# EAGLE design ADC_SPI (EAGLE 9.2.2)
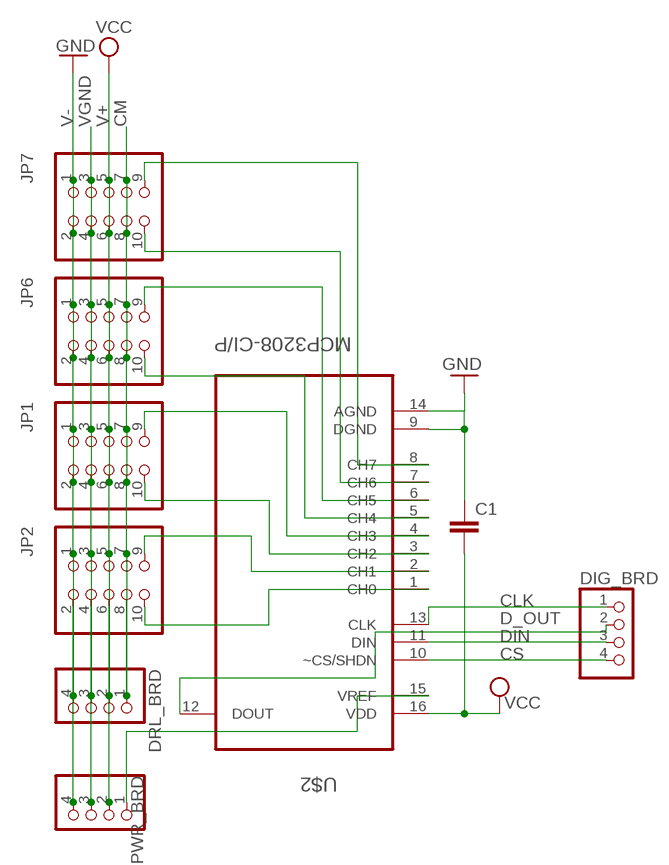
[diagram p0: schematic, sheet 1]

## Parts
C1  C2.5/2  [C2.5-2]
DIG_BRD  PINHD-1X4  [1X04]
DRL_BRD  PINHD-1X4  [1X04]
JP1  PINHD-2X5  [2X05]
JP2  PINHD-2X5  [2X05]
JP6  PINHD-2X5  [2X05]
JP7  PINHD-2X5  [2X05]
PWR_BRD  PINHD-1X4  [1X04]
U$2  MCP3208-CI/P  [DIP254P762X432-16]

## Nets
CLK: DIG_BRD.1 U$2.13(CLK)
CM: DRL_BRD.1 JP1.7 JP1.8 JP2.7 JP2.8 JP6.7 JP6.8 JP7.7 JP7.8
CS: DIG_BRD.4 U$2.10(~CS/SHDN)
D_OUT: DIG_BRD.2 U$2.12(DOUT)
DIN: DIG_BRD.3 U$2.11(DIN)
GND: C1.1 U$2.9(DGND) U$2.14(AGND)
N$1: JP2.10 U$2.1(CH0)
N$2: PWR_BRD.1 U$2.15(VREF)
N$17: JP7.9 U$2.8(CH7)
N$18: JP7.10 U$2.7(CH6)
N$19: JP6.9 U$2.6(CH5)
N$20: JP6.10 U$2.5(CH4)
N$21: JP1.9 U$2.4(CH3)
N$25: JP1.10 U$2.3(CH2)
N$32: JP2.9 U$2.2(CH1)
V+: DRL_BRD.2 JP1.5 JP1.6 JP2.5 JP2.6 JP6.5 JP6.6 JP7.5 JP7.6 PWR_BRD.2 ; supply symbol labelled VCC
V-: DRL_BRD.4 JP1.1 JP1.2 JP2.1 JP2.2 JP6.1 JP6.2 JP7.1 JP7.2 PWR_BRD.4 ; supply symbol labelled GND
VCC: C1.2 U$2.16(VDD)
VGND: DRL_BRD.3 JP1.3 JP1.4 JP2.3 JP2.4 JP6.3 JP6.4 JP7.3 JP7.4 PWR_BRD.3

## Library data of the parts
C1 = capacitor-wima:C: CAPACITOR naming: grid - package width
DIG_BRD DRL_BRD PWR_BRD = pinhead:PINHD-1X4: PIN HEADER
JP1 JP2 JP6 JP7 = pinhead:PINHD-2X5: PIN HEADER
U$2 = MCP3208-CI_P:MCP3208-CI/P: A/D Converters; AVAILABILITY: Good; DESCRIPTION: 8 Channel SPI Serial Interface 2.7 V 12-Bit A/D Converter Through Hole - PDIP-16; MF: Microchip; MP: MCP3208-CI/P; PACKAGE: DIP-16 Microchip; PRICE: 3.21 USD

## Net classes
0 default: width 0.254 mm, clearance 0.254 mm

## Board
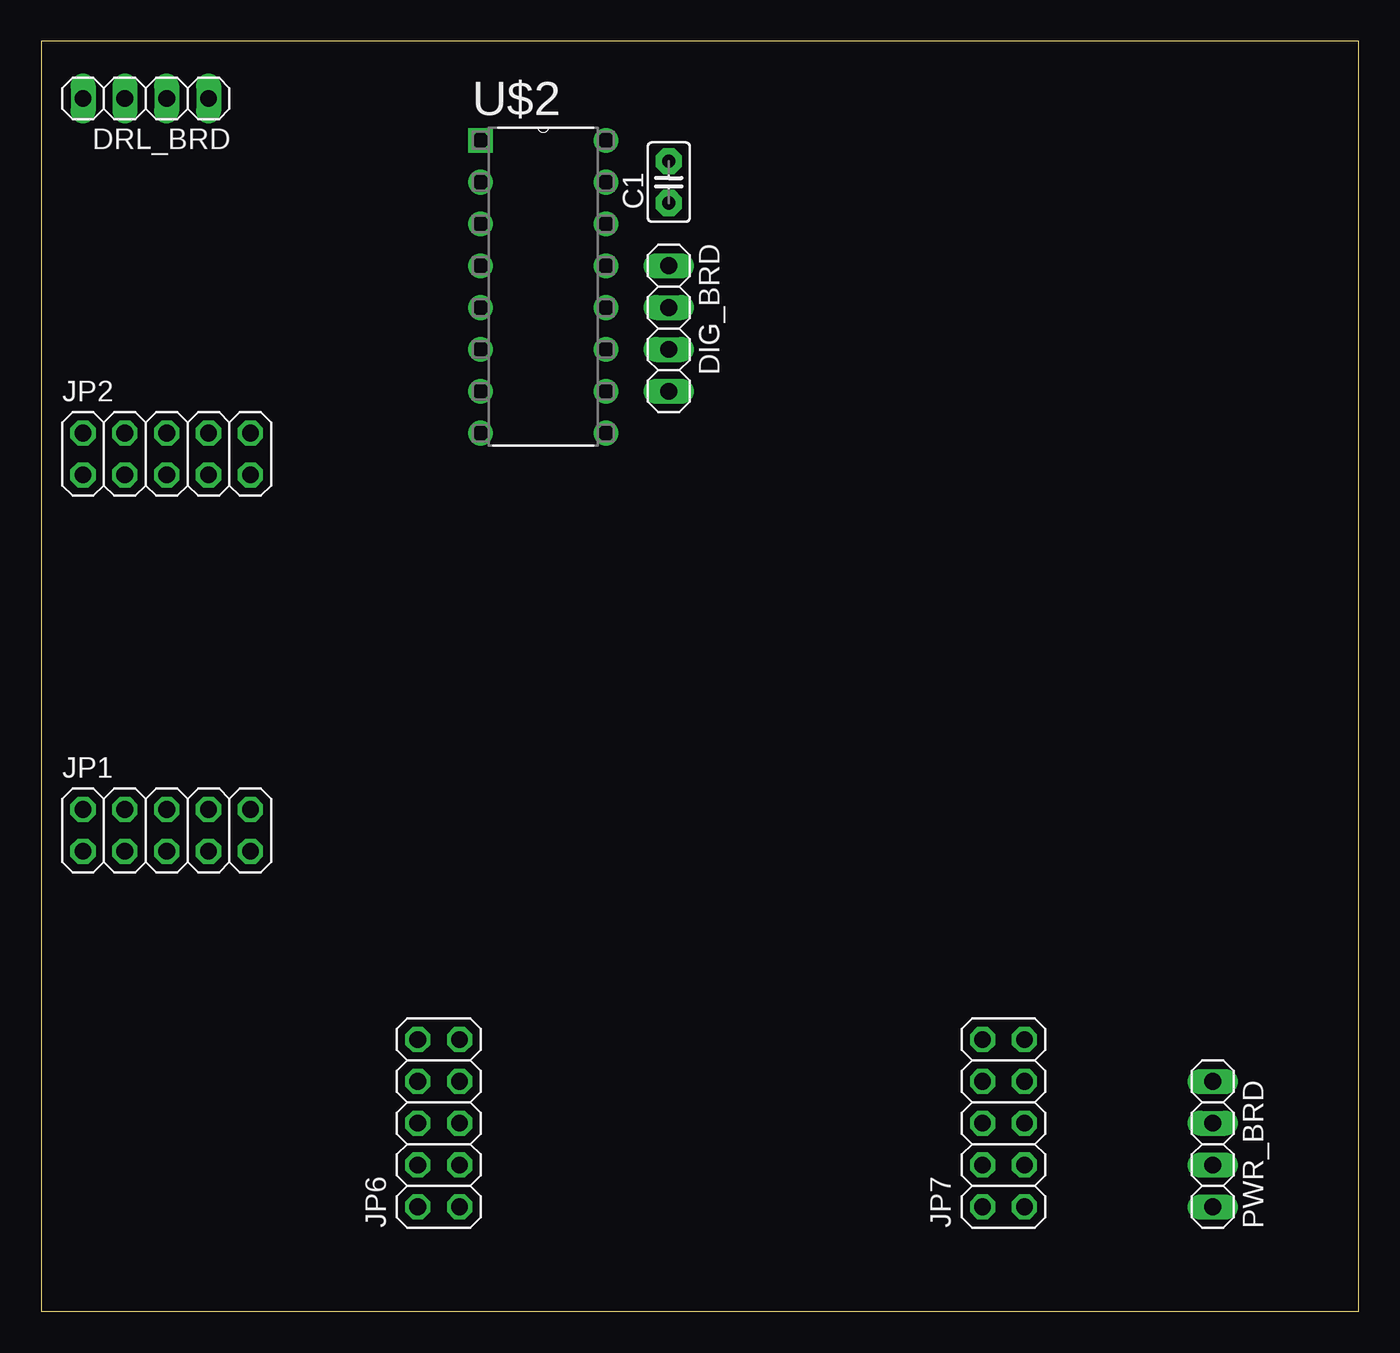
[diagram p1: board, top side]
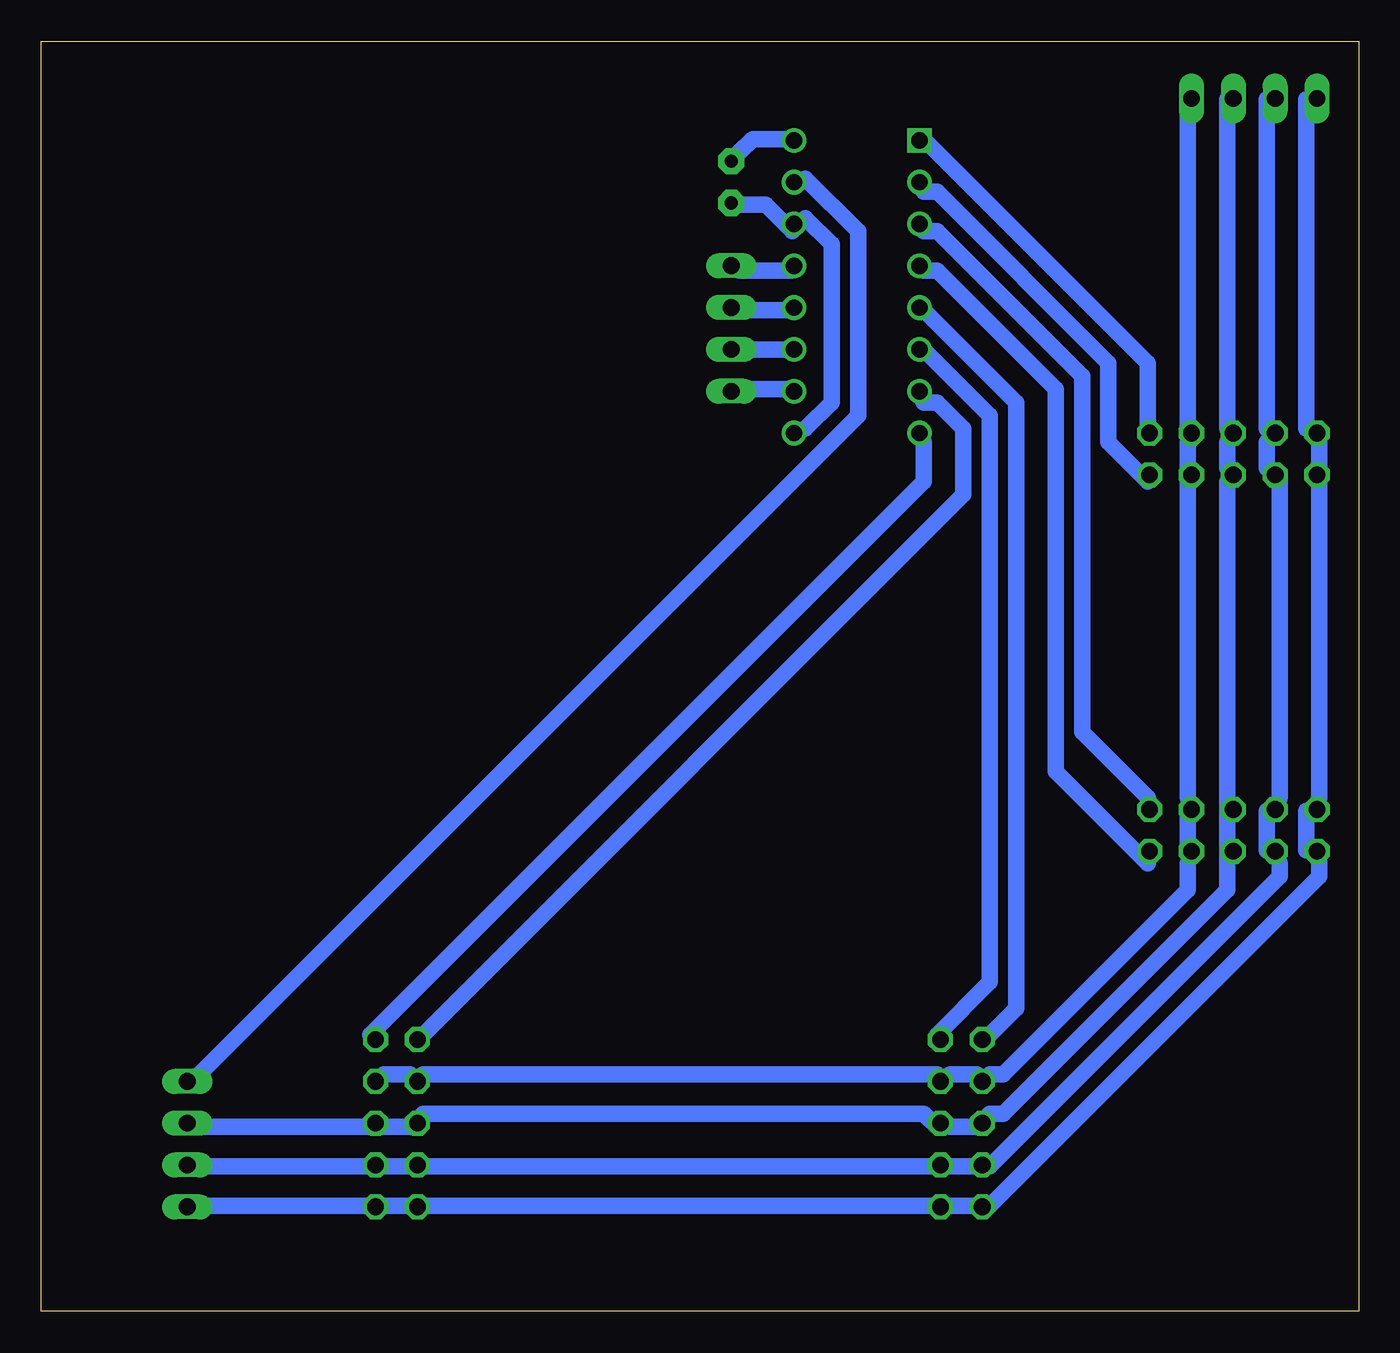
[diagram p2: board, bottom side, seen from below]

Size 79.99 x 77.14 mm. Coordinates in mm from the lower left corner, seen from the top.
Outline: 0,0 79.99,0 79.99,77.14 0,77.14 0,0
Copper layers (1*16): Top 0.035mm / dielectric 1.5mm / Bottom 0.035mm
Design rules "default *": minimum track width 1mm, minimum drill 0.35mm, track to track 0.6mm, track to pad 0.6mm, pad to pad 0.6mm, via to via 0.6mm, smd to smd 6mil, copper to edge 40mil, drill to drill 6mil, minimum pad ring 10mil, minimum via ring 8mil, stop-mask expansion 4mil, vias tented up to drill 0mil, thermal gap 10mil

### Footprints (pad centres in the part's own frame; a part is rotated, then mirrored left to right if it is on the bottom)
C2.5-2 = drill 0.813 pad 1.6 octagon: 1 -1.27,0; 2 1.27,0
1X04 = drill 1.016 long: 1 -3.81,0; 2 -1.27,0; 3 1.27,0; 4 3.81,0
2X05 = drill 1.016 octagon: 1 -5.08,-1.27; 2 -5.08,1.27; 3 -2.54,-1.27; 4 -2.54,1.27; 5 0,-1.27; 6 0,1.27; 7 2.54,-1.27; 8 2.54,1.27; 9 5.08,-1.27; 10 5.08,1.27
DIP254P762X432-16 = drill 0.991 square: 1 -7.62,17.78 | drill 0.991: 2 -7.62,15.24; 3 -7.62,12.7; 4 -7.62,10.16; 5 -7.62,7.62; 6 -7.62,5.08; 7 -7.62,2.54; 8 -7.62,0; 9 0,0; 10 0,2.54; 11 0,5.08; 12 0,7.62; 13 0,10.16; 14 0,12.7; 15 0,15.24; 16 0,17.78

### Placement (x,y rotation side)
C1  38.1,68.58 90 top
DIG_BRD  38.1,59.69 270 top
DRL_BRD  6.35,73.66 180 top
JP1  7.62,29.21 0 top
JP2  7.62,52.07 0 top
JP6  24.13,11.43 90 top
JP7  58.42,11.43 90 top
PWR_BRD  71.12,10.16 270 top
U$2  34.29,53.34 0 top

### Tracks (layer width: path | path; a pad name or v marks a point on that pad's centre or on a via)
CLK
  Bottom 1: U$2.13 34.4,63.2 37.6,63.2 DIG_BRD.1
CM
  Bottom 1: JP7.7 59.2,14.4 57.6,14.4 JP7.8 56.8,14.4 25.6,14.4 JP6.7 24.8,14.4 23.2,14.4 JP6.8 22.4,14.4 21.6,14.4 10.4,25.6 10.4,27.2 JP1.7 10.4,28 10.4,30.4 JP1.8 10.4,31.2 10.4,50.4 JP2.7 10.4,51.2 10.4,52.8 JP2.8 10.4,53.6 10.4,73.6 DRL_BRD.1
CS
  Bottom 1: U$2.10 34.4,56 37.6,56 DIG_BRD.4
D_OUT
  Bottom 1: U$2.12 34.4,60.8 37.6,60.8 DIG_BRD.2
DIN
  Bottom 1: U$2.11 34.4,58.4 37.6,58.4 DIG_BRD.3
GND
  Bottom 1: U$2.9 33.6,53.6 32,55.2 32,64.8 33.6,66.4 U$2.14 34.4,65.6 36,67.2 37.6,67.2 C1.1
N$1
  Bottom 1: U$2.1 26.4,71.2 12.8,57.6 12.8,53.6 JP2.10
N$2
  Bottom 1: U$2.15 33.6,68.8 30.4,65.6 30.4,54.4 70.4,14.4 PWR_BRD.1
N$17
  Bottom 1: U$2.8 26.4,52.8 26.4,50.4 60,16.8 JP7.9
N$18
  Bottom 1: U$2.7 26.4,55.2 25.6,55.2 24,53.6 24,49.6 56.8,16.8 JP7.10
N$19
  Bottom 1: U$2.6 26.4,58.4 22.4,54.4 22.4,20 25.6,16.8 JP6.9
N$20
  Bottom 1: U$2.5 26.4,60.8 20.8,55.2 20.8,18.4 22.4,16.8 JP6.10
N$21
  Bottom 1: U$2.4 26.4,63.2 25.6,63.2 18.4,56 18.4,32.8 12.8,27.2 JP1.9
N$25
  Bottom 1: U$2.3 26.4,65.6 25.6,65.6 16.8,56.8 16.8,35.2 12.8,31.2 JP1.10
N$32
  Bottom 1: U$2.2 26.4,68 25.6,68 15.2,57.6 15.2,52.8 12.8,50.4 JP2.9
V+
  Bottom 1: PWR_BRD.2 70.4,11.2 60,11.2 JP7.5 59.2,11.2 57.6,11.2 JP7.6 56.8,12 26.4,12 25.6,11.2 JP6.5 24.8,11.2 23.2,11.2 JP6.6 22.4,12 21.6,12 8,25.6 8,28 | 8,30.4 8,28 | DRL_BRD.2 8,73.6 8,53.6 JP2.6 8,52.8 8,51.2 JP2.5 8,50.4 8,30.4 | 8,30.4 JP1.6 | 8,28 JP1.5
V-
  Bottom 1: DRL_BRD.4 3.2,73.6 3.2,53.6 JP2.2 2.4,52.8 2.4,51.2 JP2.1 2.4,50.4 2.4,31.2 JP1.2 3.2,30.4 3.2,28 JP1.1 2.4,27.2 2.4,26.4 22.4,6.4 JP6.2 23.2,6.4 24.8,6.4 JP6.1 25.6,6.4 56.8,6.4 JP7.2 57.6,6.4 59.2,6.4 JP7.1 60,6.4 70.4,6.4 PWR_BRD.4
VCC
  Bottom 1: U$2.16 34.4,71.2 36.8,71.2 37.6,70.4 C1.2
VGND
  Bottom 1: PWR_BRD.3 70.4,8.8 60,8.8 JP7.3 59.2,8.8 57.6,8.8 JP7.4 56.8,8.8 25.6,8.8 JP6.3 24.8,8.8 23.2,8.8 JP6.4 22.4,8.8 4.8,26.4 4.8,27.2 JP1.3 5.6,28 5.6,30.4 JP1.4 4.8,31.2 4.8,50.4 JP2.3 5.6,51.2 5.6,52.8 JP2.4 5.6,53.6 5.6,73.6 DRL_BRD.3